# Altium schematic sheet dcdc-switch.SchDoc: dcdc-switch
size A4; Date: 05.10.2017; CheckedBy: UNCHECKED; Author: Leon Loeser; Organization: Baltic Racing; Address1: Zur Schwedenschanze 15; Address2: Haus 18; Address3: 18435 Stralsund; Revision: xx.xx; SheetNumber: 9; SheetTotal: 10; Rules: TODO; ProjectName: Projekt
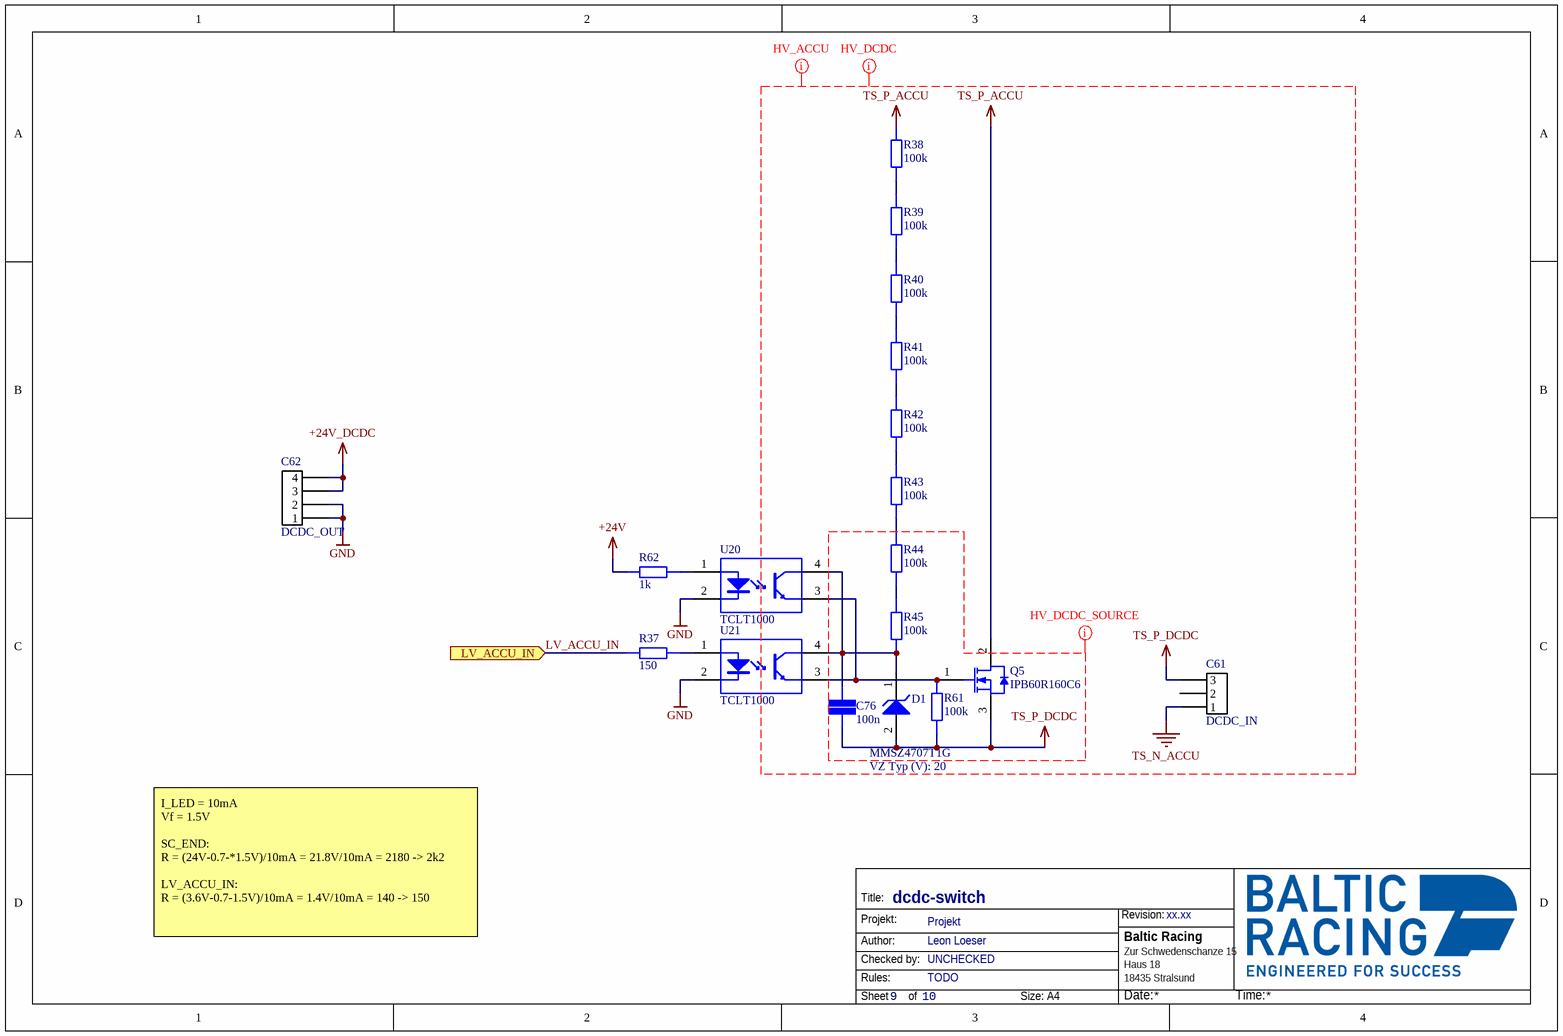
[diagram p0: dcdc-switch.SchDoc]

## Parts
C61  DCDC_IN  [43650-0315]
C62  DCDC_OUT  [76825-0004]
C76  value 100n  [CAP 0603/1608]  (hidden comment: SMD Capacitor)
D1  MMSZ4707T1G  VZ Typ (V): 20  [ONSC-SOD-123-2-425-04_V]
Q5  IPB60R160C6  [INF-PG-TO263-3-2_N]
R37  value 150  [STACKPOLE CSR1206]  (hidden comment: SMD Resistor)
R38  value 100k  [STACKPOLE CSR1206]  (hidden comment: SMD Resistor)
R39  value 100k  [STACKPOLE CSR1206]  (hidden comment: SMD Resistor)
R40  value 100k  [STACKPOLE CSR1206]  (hidden comment: SMD Resistor)
R41  value 100k  [STACKPOLE CSR1206]  (hidden comment: SMD Resistor)
R42  value 100k  [STACKPOLE CSR1206]  (hidden comment: SMD Resistor)
R43  value 100k  [STACKPOLE CSR1206]  (hidden comment: SMD Resistor)
R44  value 100k  [STACKPOLE CSR1206]  (hidden comment: SMD Resistor)
R45  value 100k  [STACKPOLE CSR1206]  (hidden comment: SMD Resistor)
R61  value 100k  [STACKPOLE CSR0603]  (hidden comment: SMD Resistor)
R62  value 1k  [STACKPOLE CSR1206]  (hidden comment: SMD Resistor)
U20  TCLT1000  [VISH-SOP4L-4_V]
U21  TCLT1000  [VISH-SOP4L-4_V]

## Ports
LV_ACCU_IN (in)

## Nets
+24V: R62.1
+24V_DCDC: C62.3 C62.4
GND: C62.1 C62.2 U20.2(C) U21.2(C)
TS_N_ACCU: C61.1
TS_P_ACCU: Q5.2(DRAIN) R38.2
TS_P_DCDC: C61.3 C76.1 D1.2(A) Q5.3(SOURCE) R61.1
LV_ACCU_IN: R37.1 ; port LV_ACCU_IN
NetC76_2: C76.2 D1.1(K) R45.1 U20.4(C) U21.4(C)
NetQ5_1: Q5.1(GATE) R61.2 U20.3(E) U21.3(E)
NetR37_2: R37.2 U21.1(A)
NetR38_1: R38.1 R39.2
NetR39_1: R39.1 R40.2
NetR40_1: R40.1 R41.2
NetR41_1: R41.1 R42.2
NetR42_1: R42.1 R43.2
NetR43_1: R43.1 R44.2
NetR44_1: R44.1 R45.2
NetR62_2: R62.2 U20.1(A)

Not connected (* = marked no-connect by the designer): C61 2

## Layout directives
net class HV_ACCU: TS_N_ACCU, TS_P_ACCU, TS_P_DCDC
net class HV_DCDC: TS_N_ACCU, TS_P_ACCU, TS_P_DCDC
net class HV_DCDC_SOURCE: TS_P_DCDC

## Notes on the sheet
- I_LED = 10mA
  Vf = 1.5V
  SC_END:
  R = (24V-0.7-*1.5V)/10mA = 21.8V/10mA = 2180 -> 2k2
  LV_ACCU_IN:
  R = (3.6V-0.7-1.5V)/10mA = 1.4V/10mA = 140 -> 150
- Title:
- Projekt:
- Revision:
- Author:
- Rules:
- Checked by:
- Sheet
- of
- Size:
- A4
- Date:
- Time:

## Library data of the parts
C61 = MicroFit3.0 3-Pin: Molex MicroFit3.0 3-Pin
C62 = MegaFit 4-Pin: Molex Mega-Fit 4-Pin / 600V / 23A
C76 = SMD Capacitor: Capacitor with multiple Footprints
D1 = CMP-1060-00328-1: Zener Voltage Regulator, 500 mW, 2-Pin SOD-123, Pb-Free, Tape and Reel; Manufacturer: On Semiconductor; P Max (W): 0.5; ComponentLink2Description: Datasheet; ComponentLink1Description: Manufacturer URL; PackageReference: SOD-123-2-425-04; PackageVersion: Rev. G, 10/2009; DatasheetVersion: Rev. 9; ComponentLink3URL: http://www.onsemi.com/pub_link/Collateral/425-04.PDF; ComponentLink2URL: http://www.onsemi.com/pub_link/Collateral/MMSZ4678T1-D.PDF; PackageDescription: 2-Pin SOD, Body 1.6 x 2.69 mm; Mounting Technology: Surface Mount; Packing: Tape and Reel; ComponentLink1URL: http://www.onsemi.com/; PartNumber: MMSZ4707T1G; ComponentLink3Description: Package Specification; RoHS: Pb-Free
Q5 = CMP-1164-00457-1: N-Channel CoolMOS C6 Power-Transistor, 600 V VDS, 23.8 A ID, -55 to 150 degC, PG-TO263-3-2, Reel, Green; Manufacturer: Infineon; VGS(th) (max): 3.5Â V; Ptot (max): 176Â W; Rth: 0.71Â K/W; Green: TRUE; QG: 75Â nC; VDS (max): 600Â V; ID (max): 23.8Â A; VGS(th) (min): 2.5Â V; RthJA (max): 62Â K/W; RDS (on) (max): 160Â mOhm; Polarity: N; IDpuls (max): 70Â A; PackageReference: PG-TO263-3-2; Halogen-free: TRUE; DatasheetVersion: Rev. 2.1; ComponentLink1URL: http://www.infineon.com/; ComponentLink3Description: Package Specification; ComponentLink1Description: Manufacturer URL; PackageVersion: Jul-09; RthJC (max): 0.71Â K/W; Packing: Reel; Mounting Technology: Surface Mount; PackageDescription: 3-Pin Plastic (Green) Transistor Single Outline Package, 10 x 9.25 mm Body, 2.54 mm Pitch; PartNumber: IPB60R160C6; ComponentLink2Description: Datasheet; ComponentLink2URL: http://www.infineon.com/dgdl/IPB60R160C6_2_1.pdf?folderId=db3a3043163797a6011638933eda014b&fileId=db3a304323b87bc20123ffdae47e5c35; Technology: CoolMOS C6; ComponentLink3URL: http://www.infineon.com/dgdl/BTS141TC_DS_10.pdf?folderId=db3a3043163797a6011667aa084c0e01&fileId=db3a3043242ebc9e01242f43f58b003e&location=en.Products.Automotive_ICs.Smart_High-_and_Low-Side_Switches.HITFET___TEMPFET__-_Smart_Low-Side_Switches.DATASHEET.BT
R37-R45 R61 R62 = SMD Resistor: Resistor with multiple footprints
U20 U21 = CMP-2000-07234-1: Optocoupler, Phototransistor Output, VCEO 70 V, -55 to 100 degC, 4-Pin SOP (SOP4L), RoHS, Tape and Reel; Manufacturer: Vishay/Semiconductor; Maximum Collector Emitter Voltage: 70V; Input Type: DC; Maximum Reverse Voltage: 6V; Maximum Collector Emitter Saturation Voltage: 300mV; Number of Channels per Chip: 1; Maximum Collector Current: 50mA; Maximum Power Dissipation: 250mW; Maximum Forward Voltage: 1.6V; Maximum Input Current: 60mA; Typical Forward Voltage: 1.25V; Minimum Isolation Voltage: 5000Vrms; Maximum Current Transfer Ratio @ Current: 600%; Manufacturer URL: http://www.vishay.com/; Package: 4SOP; Mounting Technology: SurfaceMount; Category: TransistorandPhotovoltaicOutputPhotoCouplers; Datasheet URL: http://www.vishay.com/docs/83515/tclt1000.pdf; Output Type: DC; Operating Temperature: -40to100°C; Package Description: 4-Pin Small Outline Package Integrated Circuit, Body 4.1 x 7.5 mm, Pitch 2.54 mm; Datasheet Version: Rev. 2.9, 12/2015; Package Reference: SOP4L; Packaging: Tape&Reel